# EasyEDA Pro project ProPrj_E73低功耗蓝牙键盘_2025-03-02.epro

# Schematic Schematic1
Board Name: Board1; Create Date: 2025-01-27; Page Name: E73主控; Project Name: E73低功耗蓝牙键盘; Schematic Name: Schematic1; Update Date: 2025-03-01; Company: 嘉立创EDA; Page Size: A4; Version: V1.2
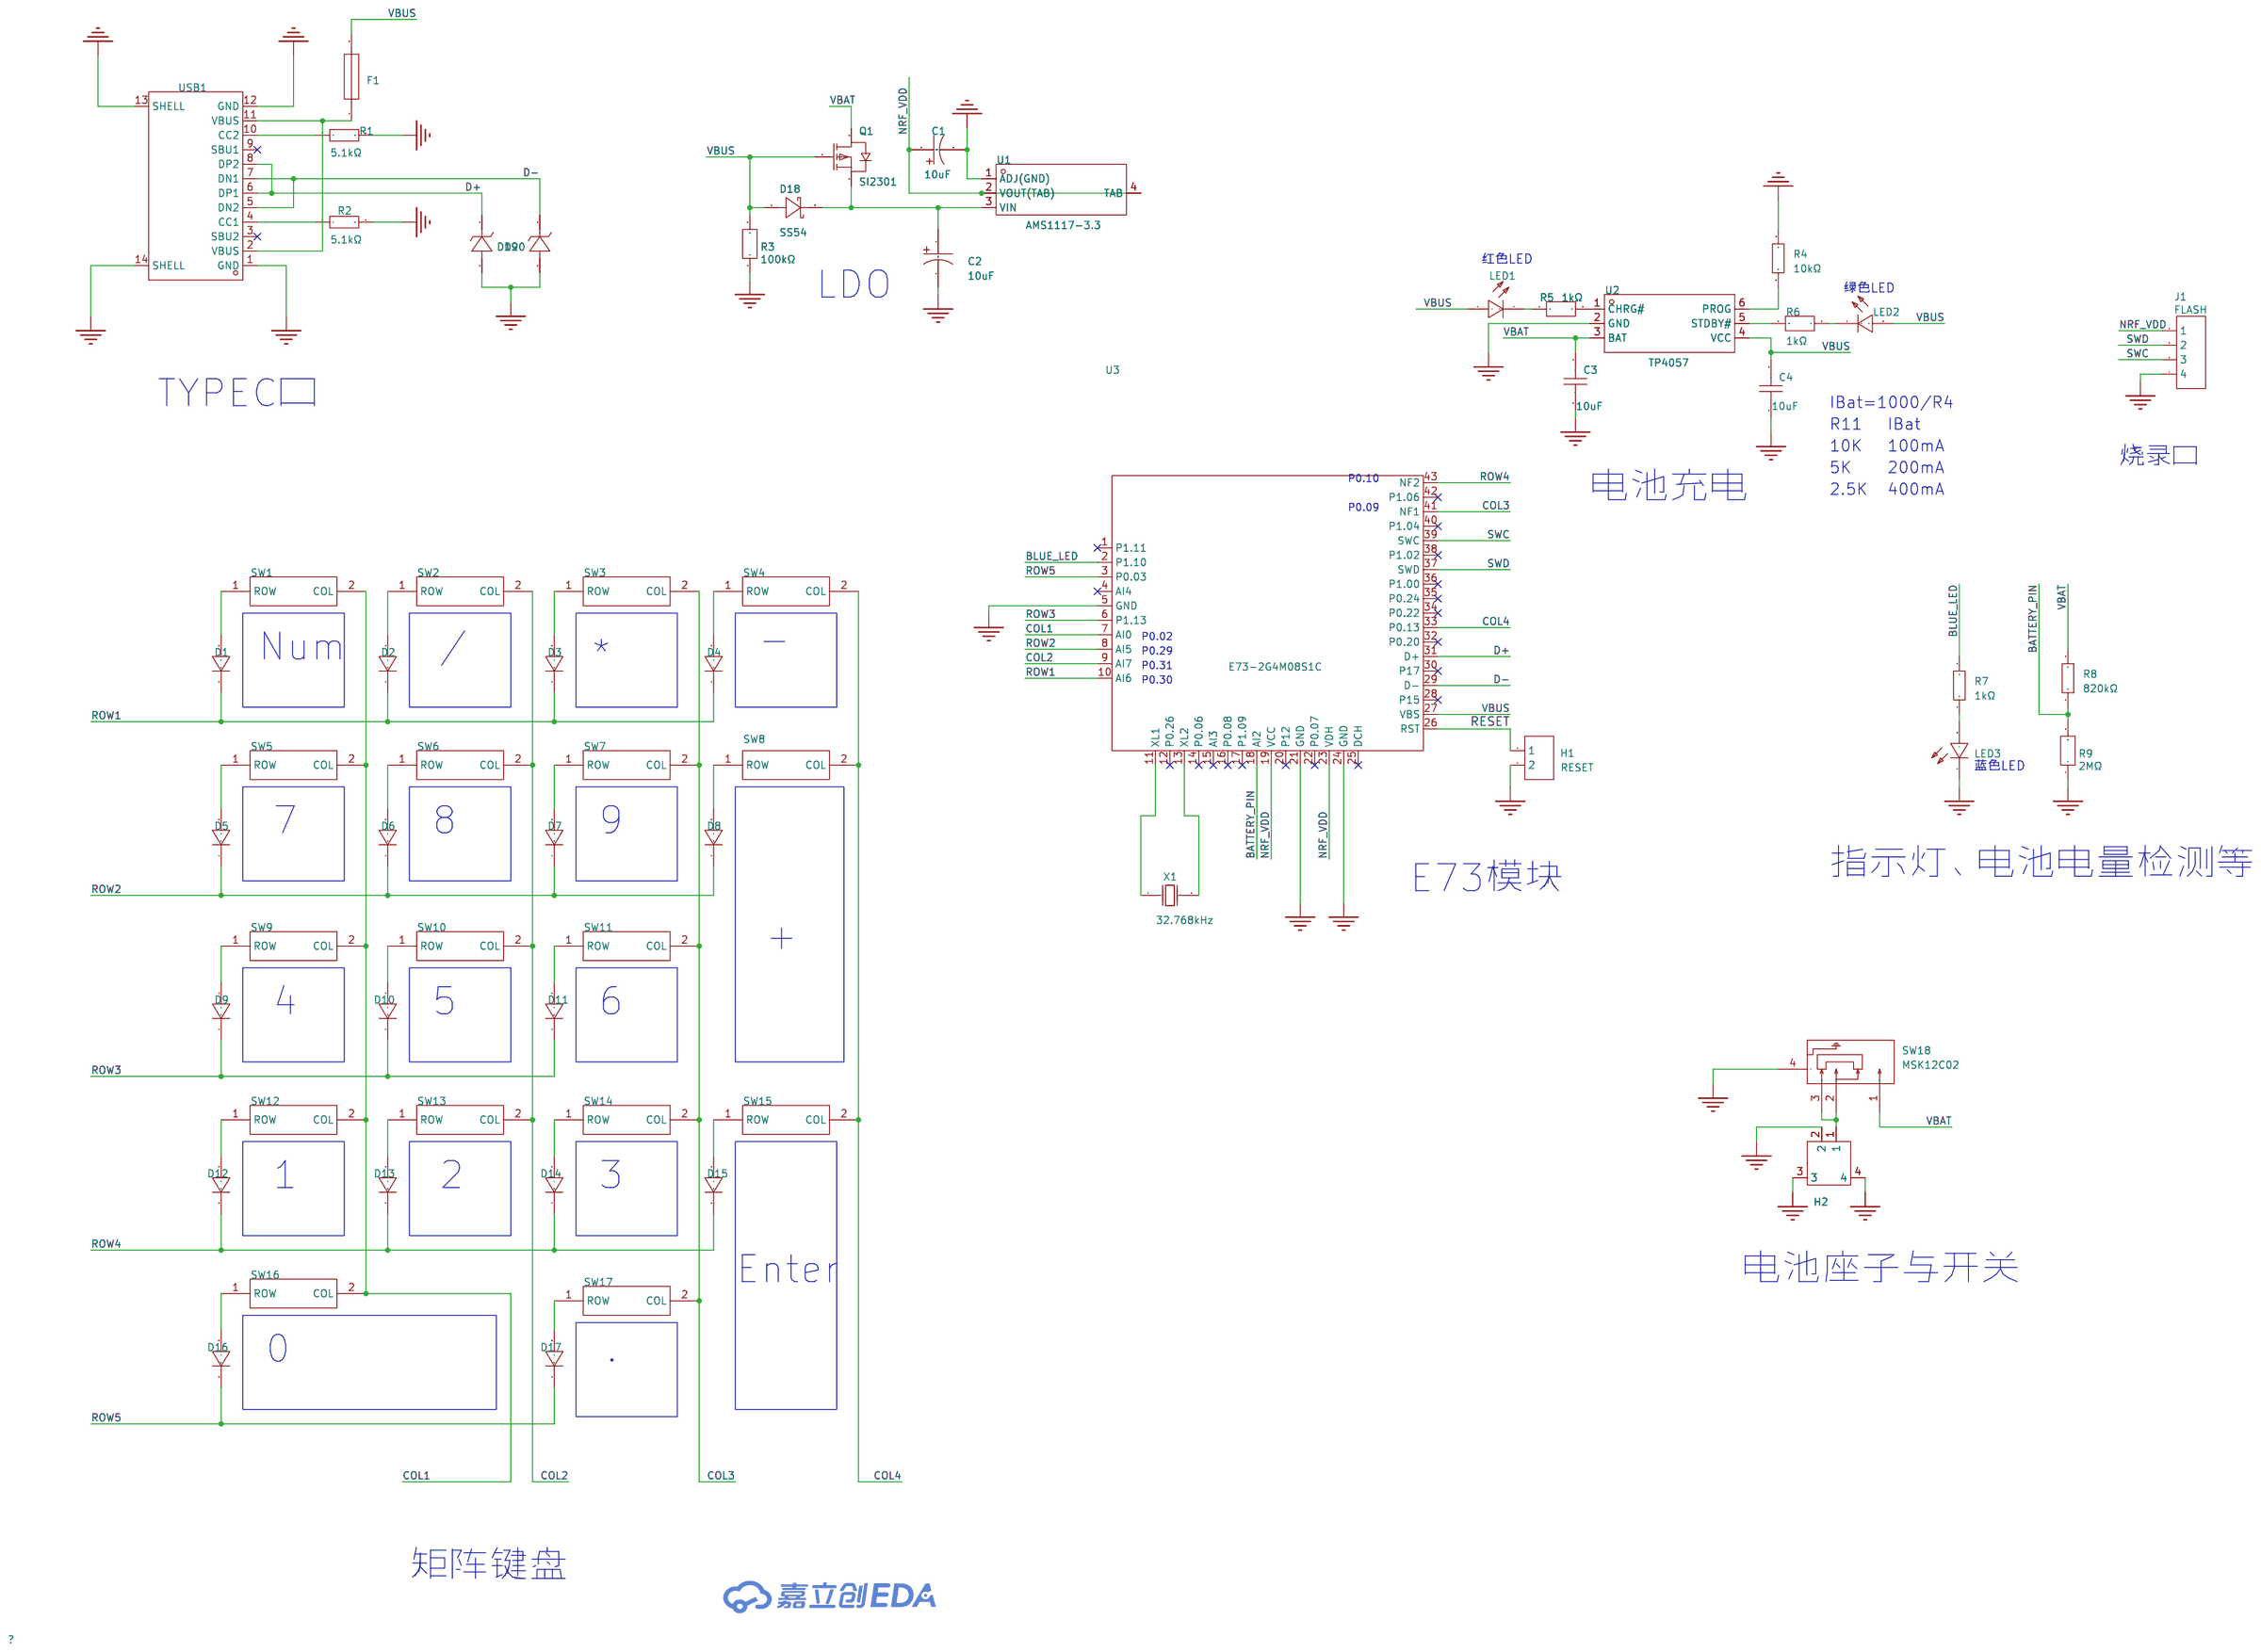
[diagram p0: schematic sheet]

## Parts
C1  10uF  [CAP-SMD_L3.2-W1.6]
C2  10uF  [CAP-SMD_L3.2-W1.6]
C3  10uF  [C0603]
C4  10uF  [C0603]
D1  LL4148  [LL-34_L3.5-W1.5-RD]
D2  LL4148  [LL-34_L3.5-W1.5-RD]
D3  LL4148  [LL-34_L3.5-W1.5-RD]
D4  LL4148  [LL-34_L3.5-W1.5-RD]
D5  LL4148  [LL-34_L3.5-W1.5-RD]
D6  LL4148  [LL-34_L3.5-W1.5-RD]
D7  LL4148  [LL-34_L3.5-W1.5-RD]
D8  LL4148  [LL-34_L3.5-W1.5-RD]
D9  LL4148  [LL-34_L3.5-W1.5-RD]
D10  LL4148  [LL-34_L3.5-W1.5-RD]
D11  LL4148  [LL-34_L3.5-W1.5-RD]
D12  LL4148  [LL-34_L3.5-W1.5-RD]
D13  LL4148  [LL-34_L3.5-W1.5-RD]
D14  LL4148  [LL-34_L3.5-W1.5-RD]
D15  LL4148  [LL-34_L3.5-W1.5-RD]
D16  LL4148  [LL-34_L3.5-W1.5-RD]
D17  LL4148  [LL-34_L3.5-W1.5-RD]
D18  SS54  [SMA_L4.3-W2.6-LS5.0-FD]
D19  BZT52C3V6S  [SOD-323_L1.7-W1.3-LS2.6-RD]
D20  BZT52C3V6S  [SOD-323_L1.7-W1.3-LS2.6-RD]
F1  JK-nSMD050-30  [F1206]
H1  RESET  [PIN02]  (no BOM)
H2  2.54-2P WT  [CONN-SMD_2.54-2PWT]
J1  FLASH  [PIN04]  (no BOM)
LED1  NCD0603R1  [LED0603-RD_RED]
LED2  NCD0603G1  [LED0603-RD_1]
LED3  NCD0603B1  [LED0603-RD]
Q1  SI2301  [SOT-23-3_L2.9-W1.3-P1.90-LS2.4-BR]
R1  5.1kΩ  [R0603]
R2  5.1kΩ  [R0603]
R3  100kΩ  [R0603]
R4  10kΩ  [R0603]
R5  1kΩ  [R0603]
R6  1kΩ  [R0603]
R7  1kΩ  [R0603]
R8  820kΩ  [R0603]
R9  2MΩ  [R0603]
SW1  -  [键盘轴座(无灯)]
SW2  -  [键盘轴座(无灯)]
SW3  -  [键盘轴座(无灯)]
SW4  -  [键盘轴座(无灯)]
SW5  -  [键盘轴座(无灯)]
SW6  -  [键盘轴座(无灯)]
SW7  -  [键盘轴座(无灯)]
SW8  -  [键盘轴座(无灯)]
SW9  -  [键盘轴座(无灯)]
SW10  -  [键盘轴座(无灯)]
SW11  -  [键盘轴座(无灯)]
SW12  -  [键盘轴座(无灯)]
SW13  -  [键盘轴座(无灯)]
SW14  -  [键盘轴座(无灯)]
SW15  -  [键盘轴座(无灯)]
SW16  -  [键盘轴座(无灯)]
SW17  -  [键盘轴座(无灯)]
SW18  MSK12C02  [SW-TH_MSK12C02]
U1  AMS1117-3.3  [SOT-223-4_L6.5-W3.5-P2.30-LS7.0-BR]
U2  TP4057  [SOT-23-6_L2.9-W1.6-P0.95-LS2.8-BR]
U3  E73-2G4M08S1C  [WIRELM-SMD_E73-2G4M08S1C]
USB1  TYPE-C 16PIN 2MD(073)  [USB-C-SMD_TYPE-C-6PIN-2MD-073]
X1  32.768kHz  [CRYSTAL-SMD_L3.2-W1.5-1]

## Library data of the parts
C1 C2 = CA45-A-16V-10μF-K: 容值:10uF;精度:±10%;额定电压:16V;等效串联电阻:2Ω@100kHz;; LCSC Part Name: 10uF ±10% 16V; Supplier Part: C185774; Manufacturer: TORCH(火炬); Supplier Footprint: CASE-A-3216-16(mm); JLCPCB Part Class: 扩展库; Datasheet: https://atta.szlcsc.com/upload/public/pdf/source/20180731/C185774_22D18ADF2389DA8E0E2B47A85772FA52.pdf; Supplier: LCSC; Tolerance: ±10%; Rated Voltage: 16V; Equivalent Series Resistance(ESR): 2Ω@100kHz; Operating Temperature: -55℃~+125℃
C3 C4 = HGC0603R5106M160NTHJ: 容值:10uF;精度:±20%;额定电压:16V;材质(温度系数):X5R;; LCSC Part Name: 10uF ±20% 16V; Supplier Part: C7472959; Manufacturer: Chinocera(华瓷); Supplier Footprint: 0603; JLCPCB Part Class: 扩展库; Datasheet: https://atta.szlcsc.com/upload/public/pdf/source/20240320/FAC3FEC40A78BC5CCCE96C232A94D860.pdf; Supplier: LCSC; Tolerance: ±20%; Voltage Rated: 16V; Temperature Coefficient: X5R
D1-D17 = LL4148_C435829: 二极管配置:-;正向压降(Vf):1V@10mA;直流反向耐压(Vr):75V;整流电流:200mA;反向恢复时间(trr):4ns;; LCSC Part Name: 电压:75V 电流:200mA; Supplier Part: C435829; Manufacturer: MDD(辰达半导体); Supplier Footprint: LL-34; JLCPCB Part Class: 扩展库; Datasheet: https://atta.szlcsc.com/upload/public/pdf/source/20230823/CF1FBF721ECE2AB22ACED5F4B72E76C8.pdf; Supplier: LCSC; Forward Voltage (Vf@If): 1V@10mA; Reverse Voltage (Vr): 75V; Rectified Current: 200mA; Reverse Leakage Current: 5uA@75V; Reverse Recovery Time (trr): 4ns
D18 = SS54_C7420369: 二极管配置:独立式;正向压降(Vf):550mV@5.0A;直流反向耐压(Vr):40V;整流电流:5A;; LCSC Part Name: 电压:40V 电流:5A; Supplier Part: C7420369; Manufacturer: 宏迦橙; Supplier Footprint: SMA(DO-214AC); JLCPCB Part Class: 扩展库; Datasheet: https://atta.szlcsc.com/upload/public/pdf/source/20230828/254C3882F8647358AD9F60DD73611B5E.pdf; Supplier: LCSC; Diode Configuration: 独立式; Forward Voltage (Vf@If): 550mV@5.0A; Reverse Voltage (Vr): 40V; Rectified Current: 5A; Reverse Leakage Current (Ir): 50uA@40V
D19 D20 = BZT52C3V6S_C19077438: 二极管配置:独立式;稳压值(标称值):3.6V;稳压值(范围):3.4V~3.8V;功率(Pd):200mW;; Supplier Part: C19077438; Manufacturer: 宏迦橙; Supplier Footprint: SOD-323; JLCPCB Part Class: 扩展库; Datasheet: https://atta.szlcsc.com/upload/public/pdf/source/20231117/06CD1C2A69B3FFC97FEAE4263E1B2FE9.pdf; Supplier: LCSC; Diode Configuration: 独立式; Zener Voltage (Nom): 3.6V; Reverse Leakage Current (Ir): 5uA@1V; Zener Voltage (Range): 3.4V~3.8V; Power Dissipation: 200mW; Zener Impedance (Zzt): 90Ω
F1 = JK-nSMD050-30: 最大电压:30V;最大电流:100A;保持电流:500mA;跳闸电流:1A;; LCSC Part Name: 30V 500mA 1206自恢复; Supplier Part: C720075; Manufacturer: JK(金科); Supplier Footprint: 1206; JLCPCB Part Class: 扩展库; Datasheet: https://atta.szlcsc.com/upload/public/pdf/source/20200810/C720075_06AF2D4541537091880CC35F0EFB49F8.pdf; Supplier: LCSC; Operating Voltage (Max): 30V; Current Rating (Max): 100A; Hold Current: 500mA; Trip Current: 1A; Power Dissipation: 600mW; Resistance - Initial (Ri) (Min): 150mΩ; Resistance - Post Trip (R1) (Max): 300mΩ; Maximum Time to Trip: 100ms; Operating Temperature: -40℃~+85℃
H1 = RESET: Supplier Part: C49661; Supplier: LCSC
H2 = 2.54-2P WT: 插针结构:1x2P;间距:2.5mm;安装方式:卧贴;参考系列:XH;总PIN数:2P;排数:1;每排PIN数:2;行距:-;额定电流:3A;触头材质:黄铜;触头镀层:锡;工作温度范围:-25℃~+85℃;; LCSC Part Name: 1x2P 间距:2.5mm 卧贴 系列:XH; Supplier Part: C668622; Manufacturer: SHOU HAN(首韩); Supplier Footprint: SMD,P=2.5mm,卧贴; JLCPCB Part Class: Extended Part; Datasheet: https://atta.szlcsc.com/upload/public/pdf/source/20200618/C668622_3082D512A2EB4A80849D85A884B9E04D.pdf; Supplier: LCSC; Pins Structure: 1x2P; Pitch: 2.5mm; Mounting Type: 卧贴; Reference Series: XH; Number of Pins: 2P; Number of Rows: 1; Number of PINs Per Row: 2; Current Rating: 3A; Contact Material: 黄铜; Contact Plating: 锡; Operating Temperature: -25℃~+85℃; Voltage Rating: 250V; Plastic Material: LCP; Flame Retardant Rating: UL94V-0; Color: 米色
J1 = FLASH: Supplier Part: C225501; Supplier: LCSC
LED1 = NCD0603R1_C84263: 灯头类型:-;发光颜色:红色;正向电压(VF):1.6V~2.6V;功率:65mW;正向电流:20mA;主波长:615nm~630nm;二极管配置:独立二极管;透镜颜色:无色透明透镜;色温:-;发光强度:80mcd~220mcd;发光角度:130°;载带方式:-;工作温度:-30℃~+85℃;; Supplier Part: C84263; Manufacturer: 国星光电; Supplier Footprint: 0603; Datasheet: https://atta.szlcsc.com/upload/public/pdf/source/20200820/C84263_DABC6A75E58F576973B407FDBA283D60.pdf; Supplier: LCSC; Emitted Color: 红色; Forward Voltage (VF): 1.6V~2.6V; Power Dissipation: 65mW; Forward Current: 20mA; Dominant Wavelength: 615nm~630nm; Diode Configuration: 独立二极管; Lens Color: 无色透明透镜; Luminous Intensity: 80mcd~220mcd; Viewing Angle: 130°; Operating Temperature: -30℃~+85℃
LED2 = NCD0603G1: 发光颜色:翠绿色;正向电压(VF):2.6V~3.6V;功率:72mW;正向电流:10mA;主波长:515nm~530nm;透镜颜色:无色透明透镜;发光强度:330mcd~900mcd;发光角度:130°;工作温度:-30℃~+85℃;; Supplier Part: C84267; Manufacturer: 国星光电; Supplier Footprint: 0603; JLCPCB Part Class: 扩展库; Datasheet: https://atta.szlcsc.com/upload/public/pdf/source/20200820/C84267_04BA7703640BAC111D09F5EFB971FBF3.pdf; Supplier: LCSC; Emitted Color: 翠绿色; Forward Voltage (VF): 2.6V~3.6V; Power Dissipation: 72mW; Forward Current: 10mA; Dominant Wavelength: 515nm~530nm; Lens Color: 无色透明透镜; Luminous Intensity: 330mcd~900mcd; Viewing Angle: 130°; Operating Temperature: -30℃~+85℃
LED3 = NCD0603B1: 发光颜色:蓝色;正向电压(VF):2.6V~3.6V;功率:72mW;正向电流:10mA;主波长:463nm~475nm;透镜颜色:无色透明透镜;发光强度:80mcd~220mcd;发光角度:130°;工作温度:-30℃~+85℃;; Supplier Part: C84266; Manufacturer: 国星光电; Supplier Footprint: 0603; Datasheet: https://atta.szlcsc.com/upload/public/pdf/source/20200820/C84266_6A3CDBEFA72C6CAD68EDA53474ADAE6C.pdf; Supplier: LCSC; Emitted Color: 蓝色; Forward Voltage (VF): 2.6V~3.6V; Power Dissipation: 72mW; Forward Current: 10mA; Dominant Wavelength: 463nm~475nm; Lens Color: 无色透明透镜; Luminous Intensity: 80mcd~220mcd; Viewing Angle: 130°; Operating Temperature: -30℃~+85℃
Q1 = SI2301_C2891731: 类型:1个P沟道;漏源电压(Vdss):20V;连续漏极电流(Id):2.2A;导通电阻(RDS(on)@Vgs,Id):120mΩ@4.5V,1.5A;功率(Pd):700mW;阈值电压(Vgs(th)@Id):1.5V@250uA;; LCSC Part Name: P沟道,电流:2.2A,耐压:20V; Supplier Part: C2891731; Manufacturer: YONGYUTAI(永裕泰); Supplier Footprint: SOT-23; JLCPCB Part Class: 扩展库; Datasheet: https://atta.szlcsc.com/upload/public/pdf/source/20210901/BD7F488CADB80954861F21BEE026F08A.pdf; Supplier: LCSC; Type: 1个P沟道; Drain Source Voltage (Vdss): 20V; Continuous Drain Current (Id): 2.2A; Drain Source On Resistance (RDS(on)@Vgs,Id): 120mΩ@4.5V,1.5A; Power Dissipation (Pd): 700mW; Gate Threshold Voltage (Vgs(th)@Id): 1.5V@250uA; Input Capacitance (Ciss@Vds): 200pF@10V; Operating Temperature: -55℃~+150℃
R1 R2 = 0603WAF5101T5E: 电阻类型:厚膜电阻;阻值:5.1kΩ;精度:±1%;功率:100mW;最大工作电压:75V;温度系数:±100ppm/℃;; LCSC Part Name: 5.1kΩ ±1% 100mW 厚膜电阻; Supplier Part: C23186; Manufacturer: UNI-ROYAL(厚声); Supplier Footprint: 0603; JLCPCB Part Class: Basic Part; Datasheet: https://atta.szlcsc.com/upload/public/pdf/source/20200306/C422600_1E6D84923E4A46A82E41ADD87F860B5C.pdf; Supplier: LCSC; Type: 厚膜电阻; Tolerance: ±1%; Power(Watts): 100mW; Overload Voltage (Max): 75V; Temperature Coefficient: ±100ppm/℃; Operating Temperature Range: -55℃~+155℃
R3 = 0603WAF1003T5E: 电阻类型:厚膜电阻;阻值:100kΩ;精度:±1%;功率:100mW;最大工作电压:75V;温度系数:±100ppm/℃;; LCSC Part Name: 100kΩ ±1% 100mW 厚膜电阻; Supplier Part: C25803; Manufacturer: UNI-ROYAL(厚声); Supplier Footprint: 0603; JLCPCB Part Class: Basic Part; Datasheet: https://atta.szlcsc.com/upload/public/pdf/source/20200306/C422600_1E6D84923E4A46A82E41ADD87F860B5C.pdf; Supplier: LCSC; Type: 厚膜电阻; Tolerance: ±1%; Power(Watts): 100mW; Overload Voltage (Max): 75V; Temperature Coefficient: ±100ppm/℃; Operating Temperature Range: -55℃~+155℃
R4 = 0603WAF1002T5E: 电阻类型:厚膜电阻;阻值:10kΩ;精度:±1%;功率:100mW;最大工作电压:75V;温度系数:±100ppm/℃;; LCSC Part Name: 厚膜电阻 10kΩ ±1% 100mW; Supplier Part: C25804; Manufacturer: UNI-ROYAL(厚声); Supplier Footprint: 0603; JLCPCB Part Class: Basic Part; Datasheet: https://atta.szlcsc.com/upload/public/pdf/source/20200306/C422600_1E6D84923E4A46A82E41ADD87F860B5C.pdf; Supplier: LCSC; Type: 厚膜电阻; Tolerance: ±1%; Power(Watts): 100mW; Overload Voltage (Max): 75V; Temperature Coefficient: ±100ppm/℃; Operating Temperature Range: -55℃~+155℃
R5-R7 = 0603WAF1001T5E: 电阻类型:厚膜电阻;阻值:1kΩ;精度:±1%;功率:100mW;最大工作电压:75V;温度系数:±100ppm/℃;; LCSC Part Name: 1kΩ ±1% 100mW 厚膜电阻; Supplier Part: C21190; Manufacturer: UNI-ROYAL(厚声); Supplier Footprint: 0603; JLCPCB Part Class: 基础库; Datasheet: https://atta.szlcsc.com/upload/public/pdf/source/20200306/C422600_1E6D84923E4A46A82E41ADD87F860B5C.pdf; Supplier: LCSC; Type: 厚膜电阻; Tolerance: ±1%; Power(Watts): 100mW; Overload Voltage (Max): 75V; Temperature Coefficient: ±100ppm/℃; Operating Temperature Range: -55℃~+155℃
R8 = 0603WAF8203T5E: 电阻类型:厚膜电阻;阻值:820kΩ;精度:±1%;功率:100mW;最大工作电压:75V;温度系数:±100ppm/℃;; LCSC Part Name: 820kΩ ±1% 100mW 厚膜电阻; Supplier Part: C23252; Manufacturer: UNI-ROYAL(厚声); Supplier Footprint: 0603; JLCPCB Part Class: 扩展库; Datasheet: https://atta.szlcsc.com/upload/public/pdf/source/20200306/C422600_1E6D84923E4A46A82E41ADD87F860B5C.pdf; Supplier: LCSC; Type: 厚膜电阻; Tolerance: ±1%; Power(Watts): 100mW; Overload Voltage (Max): 75V; Temperature Coefficient: ±100ppm/℃; Operating Temperature Range: -55℃~+155℃
R9 = 0603WAF2004T5E: 电阻类型:厚膜电阻;阻值:2MΩ;精度:±1%;功率:100mW;最大工作电压:75V;温度系数:±100ppm/℃;; LCSC Part Name: 2MΩ ±1% 100mW 厚膜电阻; Supplier Part: C22976; Manufacturer: UNI-ROYAL(厚声); Supplier Footprint: 0603; JLCPCB Part Class: Basic Part; Datasheet: https://atta.szlcsc.com/upload/public/pdf/source/20200306/C422600_1E6D84923E4A46A82E41ADD87F860B5C.pdf; Supplier: LCSC; Type: 厚膜电阻; Tolerance: ±1%; Power(Watts): 100mW; Overload Voltage (Max): 75V; Temperature Coefficient: ±100ppm/℃; Operating Temperature Range: -55℃~+155℃
SW1-SW17 = 键盘轴座(无灯)
SW18 = MSK12C02: 电路结构:单刀双掷;安装方式:卧贴;开关颜色:-;额定电流(DC):50mA;额定电压(DC):12V;额定电流(AC):-;额定电压(AC):-;机械寿命:1万次;; LCSC Part Name: 两档侧拨贴片 7脚 滑动开关; Supplier Part: C431540; Manufacturer: SHOU HAN(首韩); Supplier Footprint: SMD; JLCPCB Part Class: 扩展库; Datasheet: https://atta.szlcsc.com/upload/public/pdf/source/20190925/C431540_89155AEF0758B9AD1B2D805F83FB12E3.pdf; Supplier: LCSC; Circuit: 单刀双掷; Pin Style: SMD接片; Switch Length: 8mm; Switch Width: 2.8mm; Switch Height: 1.4mm; Mounting Style: 卧贴; Current Rating (DC): 50mA; Voltage Rating (DC): 12V; Mechanical Life: 1万次; Operating Temperature: -20℃~+70℃
U1 = AMS1117-3.3_C347222: 输出类型:固定;工作电压:12V;输出电压:3.3V;输出电流:1A;电源纹波抑制比(PSRR):60dB@(120Hz);输出极性:正极;; LCSC Part Name: 输出:3.3V 电流:1A 耐压:12V; Supplier Part: C347222; Manufacturer: UMW(友台半导体); Supplier Footprint: SOT-223; JLCPCB Part Class: 扩展库; Datasheet: https://atta.szlcsc.com/upload/public/pdf/source/20241218/BAF0263FA2E44BCD8AF41AA4FA04EFAA.pdf; Supplier: LCSC; Output Type: 固定; Maximum Input Voltage: 12V; Output Voltage: 3.3V; Output Current: 1A; Power Supply Rejection Ratio (PSRR): 60dB@(120Hz); Dropout Voltage: 1.3V@(1A); Feature: 过流保护(OCP); Output Polarity: 正极; Number of Outputs: 1
U2 = TP4057: 电源电压:6.5V;最大充电电流:500mA;电池类型:锂离子/聚合物;电池节数:1;; Supplier Part: C725791; Manufacturer: UMW(友台半导体); Supplier Footprint: SOT-23-6; JLCPCB Part Class: 扩展库; Datasheet: https://atta.szlcsc.com/upload/public/pdf/source/20231109/7FB39B0490CD1514A6792371FCA0BB30.pdf; Supplier: LCSC; Supply Voltage: 6.5V; Maximum Charge Current: 500mA; Type of Battery: 锂离子/聚合物; Number of Cells: 1; Operating Temperature: -40℃~+85℃
U3 = E73-2G4M08S1C: 1、原装进口nRF52840射频芯片。2、支持蓝牙4.2和5.0协议。3、芯片自带高性能ARM CORTEX-M4F内核。4、芯片自带32.768K实时时钟。5、四层高性能PCB板，射频特性优异，可以通过各种认证。6、模块引出了大部分的IO口。7、模块出厂无程序，用户需要进行二次开发。; Supplier Part: C356849; Manufacturer: EBYTE(亿佰特); Datasheet: https://atta.szlcsc.com/upload/public/pdf/source/20190802/C356849_057FD2ABDA7635054C2E243A545E6C9F.pdf; Supplier: LCSC
USB1 = TYPE-C 16PIN 2MD(073): 连接器类型:Type-C;标准:USB 3.1;公母:母;安装方式:卧贴;触点数量:16P;端口数量:1;额定电流 - 电源:5A;工作温度范围:-25℃~+85℃;; LCSC Part Name: Type-C 母 卧贴; Supplier Part: C2765186; Manufacturer: SHOU HAN(首韩); Supplier Footprint: SMD; JLCPCB Part Class: 扩展库; Datasheet: https://atta.szlcsc.com/upload/public/pdf/source/20211123/39B17C16241EAC15C5E277BDA434118E.pdf; Supplier: LCSC; Connector Type: Type-C; Standard: USB 3.1; Gender: 母; Mounting Style: 卧贴; Number of Contacts: 16P; Number of Ports: 1; Current Rating - Power (Max): 5A; Operating Temperature Range: -25℃~+85℃; Rated Voltage (Max): 5V; Connect-Disconnect Life: 5千次; Core Colour: 黑色
X1 = XKXGI-SUA-32.768K: 晶振类型:贴片晶振;频率:32.768kHz;常温频差:±20ppm;负载电容:12.5pF;频率稳定度:±30ppm;; LCSC Part Name: 32.768kHz ±20ppm 12.5pF; Supplier Part: C5213671; Manufacturer: YXC(扬兴晶振); Supplier Footprint: SMD3215-2P; JLCPCB Part Class: 扩展库; Datasheet: https://atta.szlcsc.com/upload/public/pdf/source/20240329/3A7650FD985DD0DE85694D3785AB4916.pdf; Supplier: LCSC; Crystal Type: 贴片晶振; Normal temperature Frequency Tolerance: ±20ppm; Load Capacitor: 12.5pF; Frequency Stability: ±30ppm; Operating Temperature: -40℃~+85℃

## Nets
GND: C1.2 C2.2 C3.2 C4.1 D19.2(A) D20.2(A) H1.2 H2.2 H2.3 H2.4 J1.4 LED3.1(-) R1.2 R2.2 R3.1 R4.2 R9.1 SW18.4 U1.1(ADJ(GND)) U2.2(GND) U3.5(GND) U3.21(GND) U3.24(GND) USB1.1(GND) USB1.12(GND) USB1.13(SHELL) USB1.14(SHELL)
VBAT: C3.1 Q1.3(D) R8.2 SW18.1 U2.3(BAT)
VBUS: C4.2 D18.1(A) F1.2 LED1.2(A) LED2.2(A) Q1.1(G) R3.2 U2.4(VCC) U3.27(VBS)
BATTERY_PIN: R8.1 R9.2 U3.18(AI2)
BLUE_LED: R7.2 U3.2(P1.10)
COL1: SW1.2(COL) SW5.2(COL) SW9.2(COL) SW12.2(COL) SW16.2(COL) U3.7(AI0)
COL2: SW2.2(COL) SW6.2(COL) SW10.2(COL) SW13.2(COL) U3.9(AI7)
COL3: SW3.2(COL) SW7.2(COL) SW11.2(COL) SW14.2(COL) SW17.2(COL) U3.41(NF1)
COL4: SW4.2(COL) SW8.2(COL) SW15.2(COL) U3.33(P0.13)
D+: D19.1(K) U3.31(D+) USB1.6(DP1) USB1.8(DP2)
D-: D20.1(K) U3.29(D-) USB1.5(DN2) USB1.7(DN1)
NRF_VDD: C1.1 J1.1 U1.2(VOUT(TAB)) U1.4(TAB) U3.19(VCC) U3.23(VDH)
RESET: H1.1 U3.26(RST)
ROW1: D1.1(C) D2.1(C) D3.1(C) D4.1(C) U3.10(AI6)
ROW2: D5.1(C) D6.1(C) D7.1(C) D8.1(C) U3.8(AI5)
ROW3: D9.1(C) D10.1(C) D11.1(C) U3.6(P1.13)
ROW4: D12.1(C) D13.1(C) D14.1(C) D15.1(C) U3.43(NF2)
ROW5: D16.1(C) D17.1(C) U3.3(P0.03)
SWC: J1.3 U3.39(SWC)
SWD: J1.2 U3.37(SWD)
$1N3146: U3.11(XL1) X1.1(OSC1)
$1N3148: U3.13(XL2) X1.2(OSC2)
$1N4004: F1.1 USB1.2(VBUS) USB1.11(VBUS)
$1N4007: R1.1 USB1.10(CC2)
$1N4018: R2.1 USB1.4(CC1)
$1N4421: LED3.2(+) R7.1
$1N18766: C2.1 D18.2(K) Q1.2(S) U1.3(VIN)
$1N20018: H2.1 SW18.2 SW18.3
$1N24035: R6.2 U2.5(STDBY#)
$1N24165: LED2.1(K) R6.1
$1N24411: LED1.1(K) R5.1
$1N24412: R5.2 U2.1(CHRG#)
$1N24490: R4.1 U2.6(PROG)
$1N53538: D3.2(A) SW3.1(ROW)
$1N53539: D2.2(A) SW2.1(ROW)
$1N53540: D1.2(A) SW1.1(ROW)
$1N53541: D4.2(A) SW4.1(ROW)
$1N53542: D7.2(A) SW7.1(ROW)
$1N53544: D5.2(A) SW5.1(ROW)
$1N53545: D9.2(A) SW9.1(ROW)
$1N53547: D11.2(A) SW11.1(ROW)
$1N53548: D8.2(A) SW8.1(ROW)
$1N53550: D13.2(A) SW13.1(ROW)
$1N53551: D12.2(A) SW12.1(ROW)
$1N53552: D16.2(A) SW16.1(ROW)
$1N56506: D10.2(A) SW10.1(ROW)
$1N56555: D14.2(A) SW14.1(ROW)
$1N56961: D6.2(A) SW6.1(ROW)
$1N57097: D15.2(A) SW15.1(ROW)
$1N57128: D17.2(A) SW17.1(ROW)

Not connected (* = marked no-connect by the designer): U3 1(P1.11)* 4(AI4)* 12(P0.26)* 14(P0.06)* 15(AI3)* 16(P0.08)* 17(P1.09)* 20(P12)* 22(P0.07)* 25(DCH)* 28(P15)* 30(P17)* 32(P0.20)* 34(P0.22)* 35(P0.24)* 36(P1.00)* 38(P1.02)* 40(P1.04)* 42(P1.06)*; USB1 3(SBU2)* 9(SBU1)*

## Notes on the sheet
- 红色LED
- LDO
- 绿色LED
- TYPEC口
- IBat=1000/R4
- R11
- IBat
- 10K
- 100mA
- 烧录口
- P0.10
- 5K
- 200mA
- P0.09
- 电池充电
- 2.5K
- 400mA
- P0.02
- -
- P0.29
- Num
- /
- *
- P0.31
- P0.30
- 蓝色LED
- 7
- 8
- 9
- 指示灯、电池电量检测等
- E73模块
- +
- 4
- 5
- 6
- 1
- 2
- 3
- Enter
- 电池座子与开关
- 0
- .
- 矩阵键盘

# Board PCB1
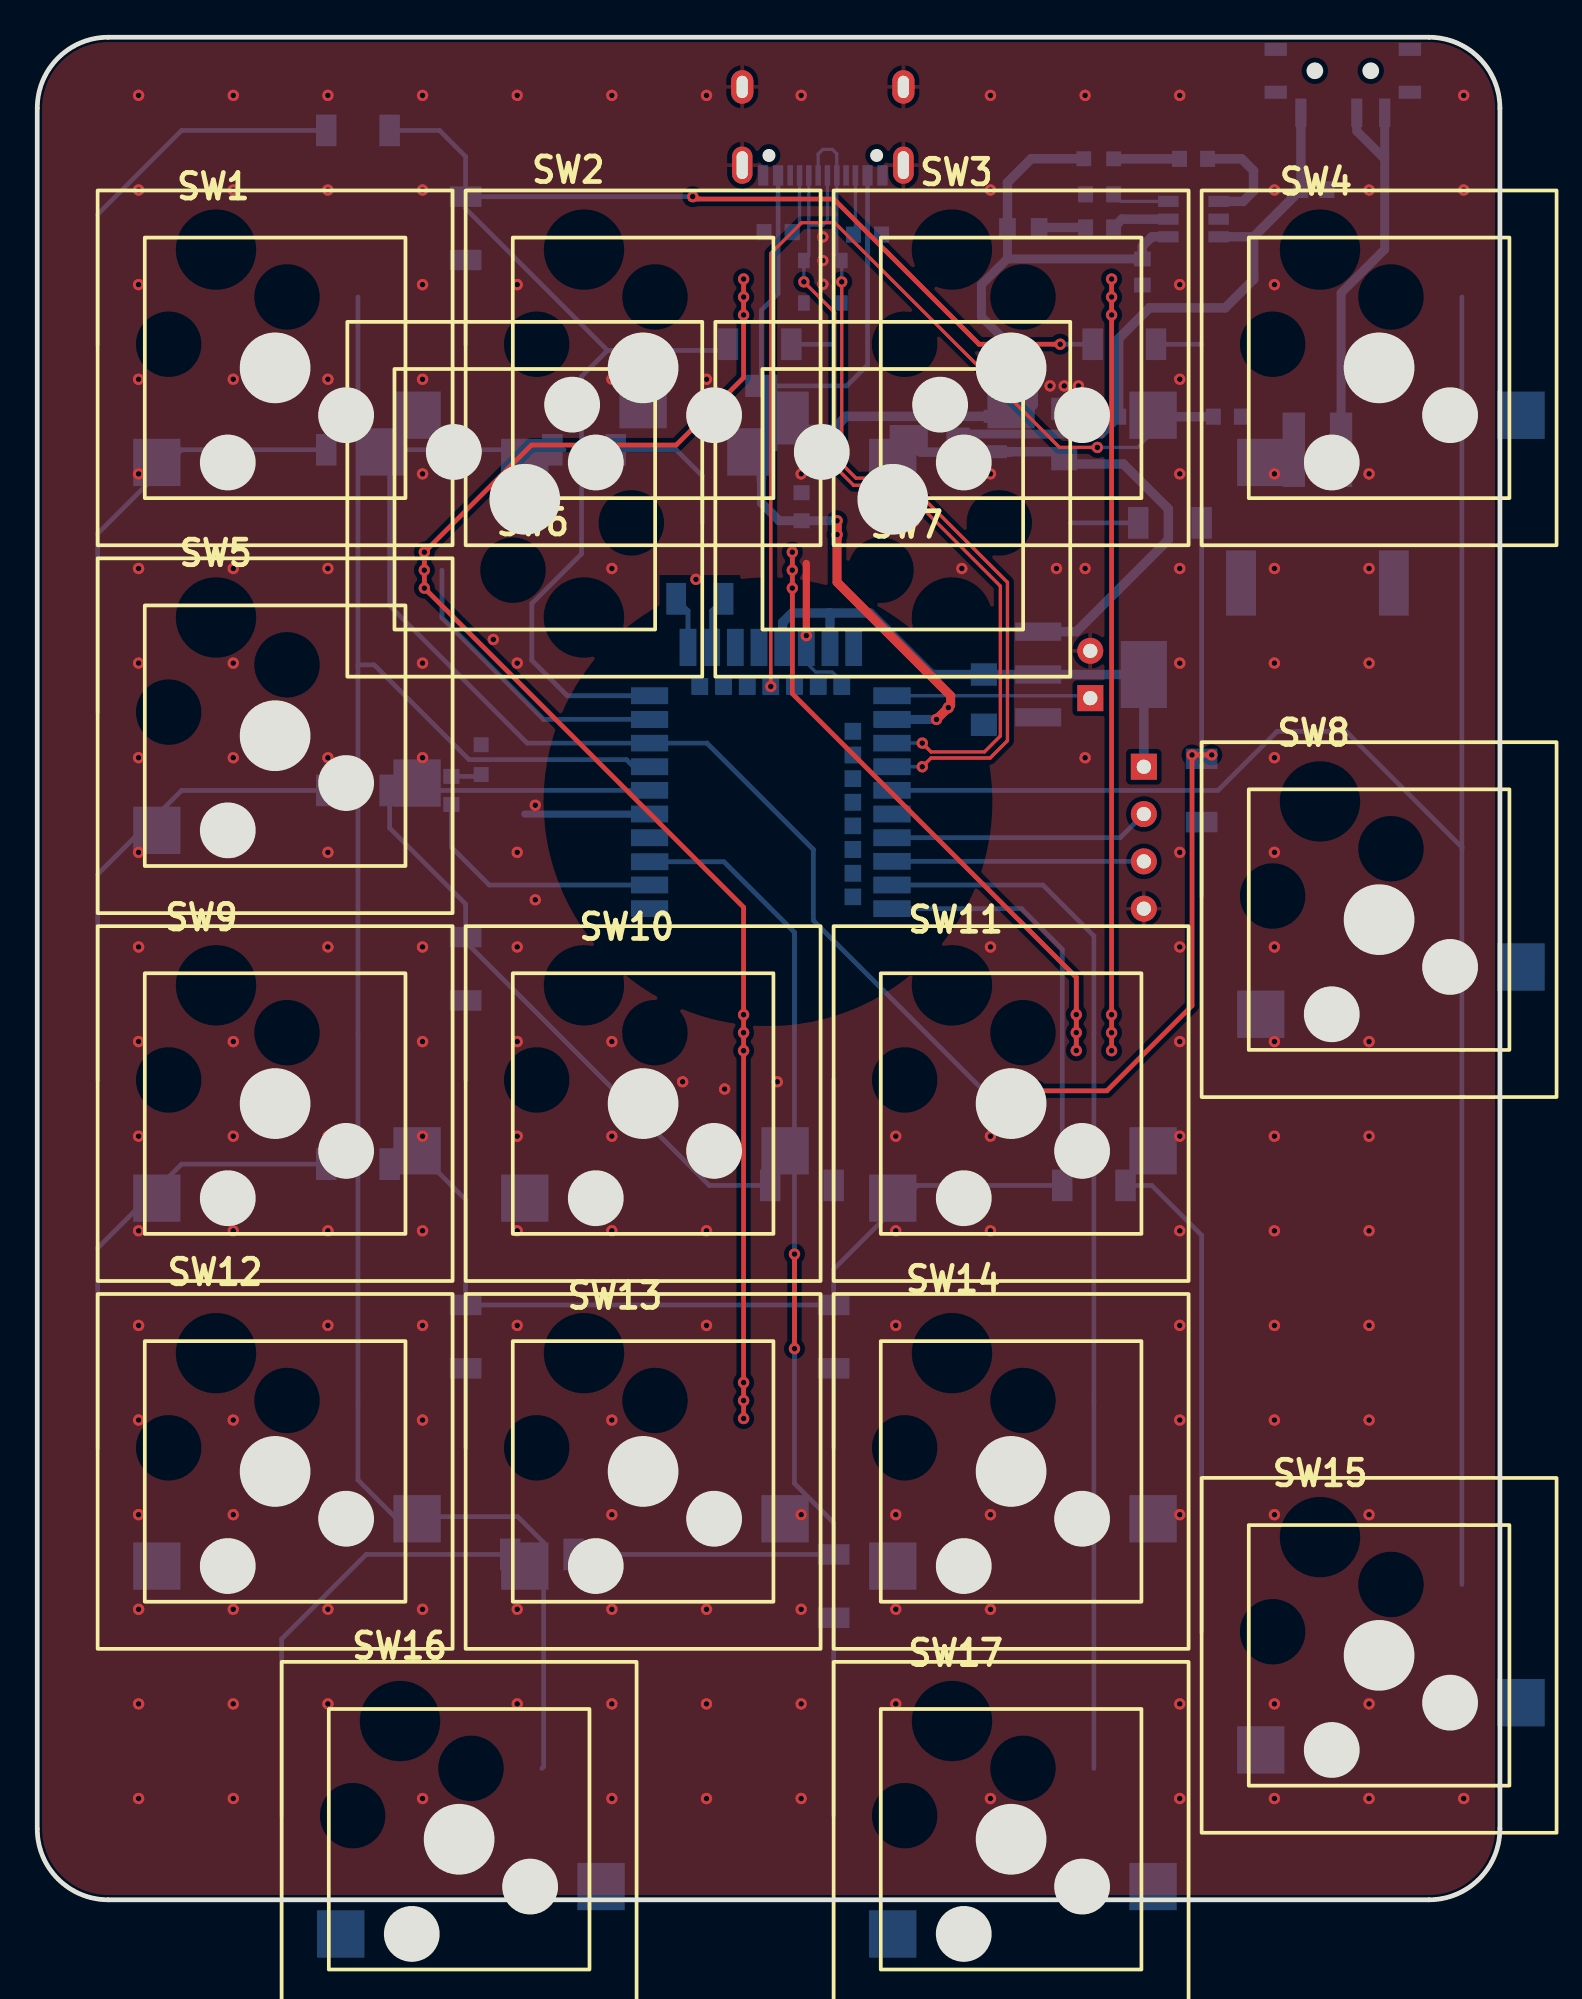
[diagram p1: board, top side]
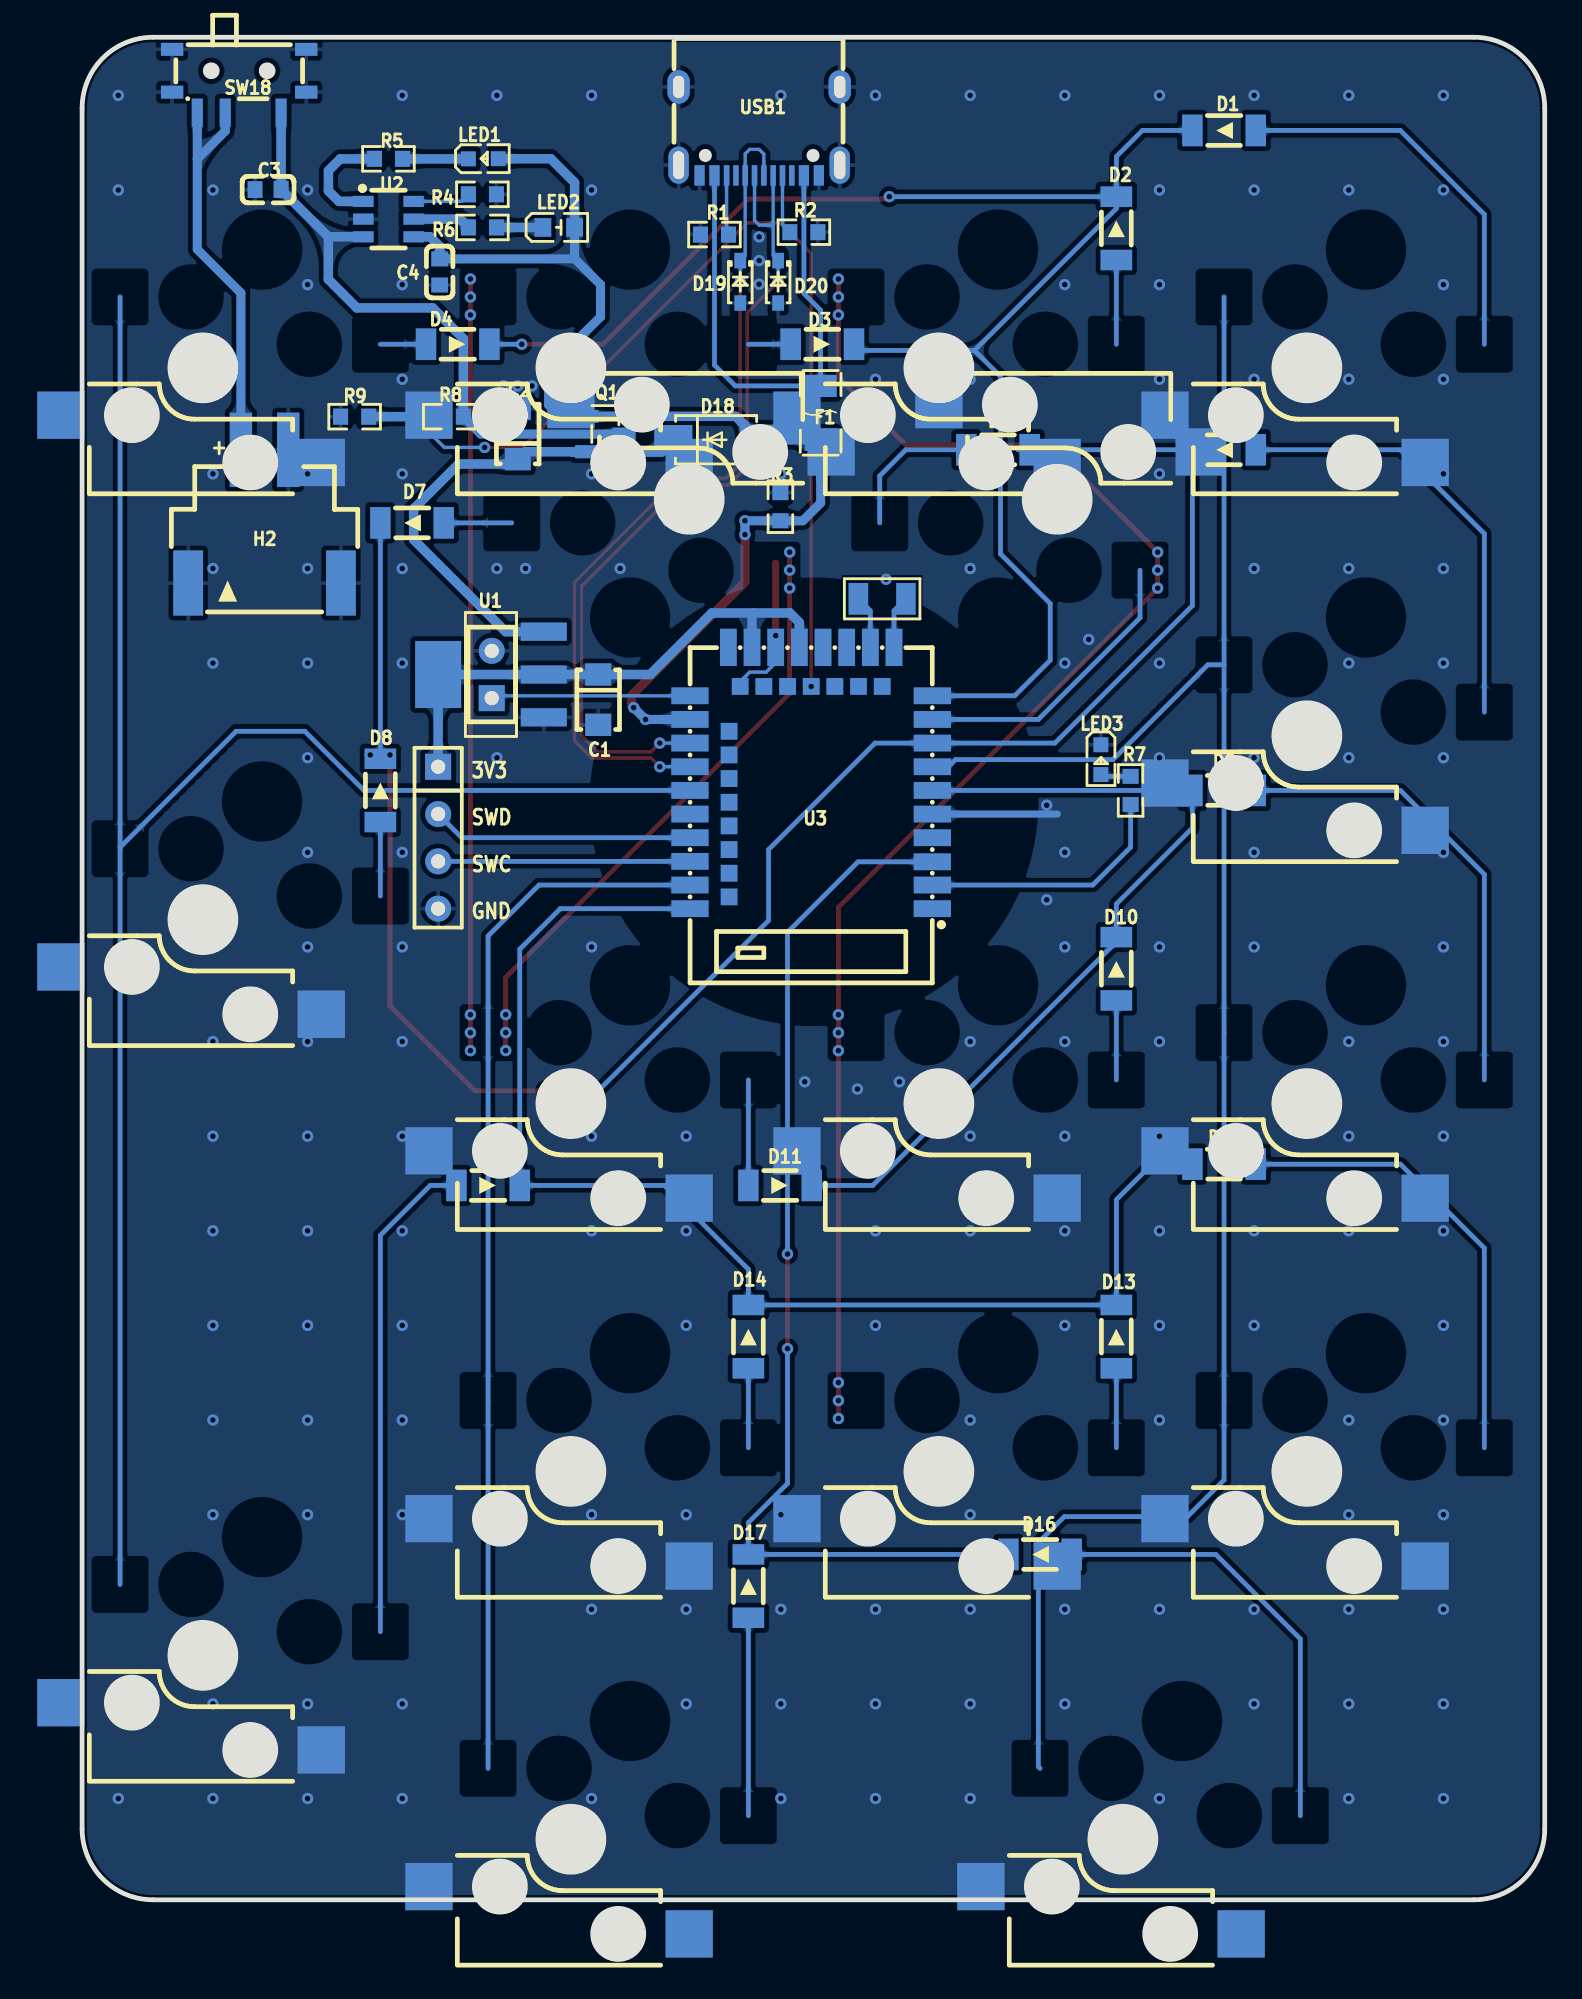
[diagram p2: board, bottom side, seen from below]

Outline 78.5 x 103.33 mm; copper layers: Top Layer, Bottom Layer. Coordinates in mm from the lower left corner of the outline.
Outline path: 0,99.52 arc(1.12,102.21) 3.81,103.33 74.69,103.33 arc(77.38,102.21) 78.5,99.52 78.5,7.14 arc(77.38,4.44) 74.69,3.33 3.81,3.33 arc(1.12,4.44) 0,7.14 0,99.52
Stack: Top Layer 0.035mm / Dielectric1 1.51mm FR4 er 4.5 / Bottom Layer 0.035mm

## Design rules (mm)
net D+: DP1
net D-: DP1
template: JLCPCB Capability(Two Layers Board)
spacing copperThickness1oz (default): track to track 0.102, other pairs 0.152 to 0.3
spacing copperThickness2oz: track to track 0.203, other pairs 0.152 to 0.3
track width copperThickness1oz (default): min 0.127, default 0.254, max 2.54
track width copperThickness2oz: min 0.203, default 0.254, max 2.54
differential pair differentialPair (default): width min 0.127, default 0.254, max 2.54; gap min 0.152, default 0.152
via viaSize (default): diameter min 0.5, default 0.61, max 10; hole min 0.3, default 0.305, max 6.3

## Placement (name value [footprint] x y rotation side)
C1  10uF  [CAP-SMD_L3.2-W1.6]  50.8 67.76 270 bottom
C2  10uF  [CAP-SMD_L3.2-W1.6]  55.12 82.02 90 bottom
C3  10uF  [C0603]  68.52 95.15 0 bottom
C4  10uF  [C0603]  59.31 90.72 90 bottom
D1  LL4148  [LL-34_L3.5-W1.5-RD]  17.21 98.32 180 bottom
D2  LL4148  [LL-34_L3.5-W1.5-RD]  22.99 93.07 270 bottom
D3  LL4148  [LL-34_L3.5-W1.5-RD]  38.77 86.84 0 bottom
D4  LL4148  [LL-34_L3.5-W1.5-RD]  58.34 86.84 0 bottom
D5  LL4148  [LL-34_L3.5-W1.5-RD]  17.21 81.18 180 bottom
D6  LL4148  [LL-34_L3.5-W1.5-RD]  29.34 81.18 0 bottom
D7  LL4148  [LL-34_L3.5-W1.5-RD]  60.79 77.25 180 bottom
D8  LL4148  [LL-34_L3.5-W1.5-RD]  62.49 62.89 270 bottom
D9  LL4148  [LL-34_L3.5-W1.5-RD]  17.21 62.89 180 bottom
D10  LL4148  [LL-34_L3.5-W1.5-RD]  22.99 53.31 270 bottom
D11  LL4148  [LL-34_L3.5-W1.5-RD]  41.04 41.68 0 bottom
D12  LL4148  [LL-34_L3.5-W1.5-RD]  17.21 42.82 180 bottom
D13  LL4148  [LL-34_L3.5-W1.5-RD]  22.99 33.56 270 bottom
D14  LL4148  [LL-34_L3.5-W1.5-RD]  42.74 33.56 270 bottom
D15  LL4148  [LL-34_L3.5-W1.5-RD]  56.71 41.68 0 bottom
D16  LL4148  [LL-34_L3.5-W1.5-RD]  27.09 21.87 180 bottom
D17  LL4148  [LL-34_L3.5-W1.5-RD]  42.74 20.17 270 bottom
D18  SS54  [SMA_L4.3-W2.6-LS5.0-FD]  44.47 81.71 0 bottom
D19  BZT52C3V6S  [SOD-323_L1.7-W1.3-LS2.6-RD]  43.18 90.2 270 bottom
D20  BZT52C3V6S  [SOD-323_L1.7-W1.3-LS2.6-RD]  41.14 90.2 270 bottom
F1  JK-nSMD050-30  [F1206]  38.86 83.16 270 bottom
H1  RESET  [PIN02]  56.51 69.11 90 bottom
H2  2.54-2P WT  [CONN-SMD_2.54-2PWT]  68.71 77.6 180 bottom
J1  FLASH  [PIN04]  59.39 60.35 180 bottom
LED1  NCD0603R1  [LED0603-RD_RED]  56.97 96.8 180 bottom
LED2  NCD0603G1  [LED0603-RD_1]  52.92 93.11 180 bottom
LED3  NCD0603B1  [LED0603-RD]  23.82 64.54 270 bottom
Q1  SI2301  [SOT-23-3_L2.9-W1.3-P1.90-LS2.4-BR]  50.42 82.02 0 bottom
R1  5.1kΩ  [R0603]  44.56 92.73 0 bottom
R2  5.1kΩ  [R0603]  39.76 92.86 180 bottom
R3  100kΩ  [R0603]  41.02 78.12 270 bottom
R4  10kΩ  [R0603]  57.01 94.89 180 bottom
R5  1kΩ  [R0603]  62.06 96.8 0 bottom
R6  1kΩ  [R0603]  57.01 93.11 0 bottom
R7  1kΩ  [R0603]  22.22 62.89 270 bottom
R8  820kΩ  [R0603]  58.79 82.95 180 bottom
R9  2MΩ  [R0603]  63.87 82.95 180 bottom
SW1  -  [键盘轴座(无灯)]  9.59 91.92 0 top
SW2  -  [键盘轴座(无灯)]  29.34 91.92 0 top
SW3  -  [键盘轴座(无灯)]  49.09 91.92 0 top
SW4  -  [键盘轴座(无灯)]  68.84 91.92 0 top
SW5  -  [键盘轴座(无灯)]  9.59 72.17 0 top
SW6  -  [键盘轴座(无灯)]  29.34 72.17 180 top
SW7  -  [键盘轴座(无灯)]  49.09 72.17 180 top
SW8  -  [键盘轴座(无灯)]  68.84 62.3 0 top
SW9  -  [键盘轴座(无灯)]  9.59 52.42 0 top
SW10  -  [键盘轴座(无灯)]  29.34 52.42 0 top
SW11  -  [键盘轴座(无灯)]  49.09 52.42 0 top
SW12  -  [键盘轴座(无灯)]  9.59 32.67 0 top
SW13  -  [键盘轴座(无灯)]  29.34 32.67 0 top
SW14  -  [键盘轴座(无灯)]  49.09 32.67 0 top
SW15  -  [键盘轴座(无灯)]  68.84 22.8 0 top
SW16  -  [键盘轴座(无灯)]  19.47 12.92 0 top
SW17  -  [键盘轴座(无灯)]  49.09 12.92 0 top
SW18  MSK12C02  [SW-TH_MSK12C02]  70.07 100.98 0 bottom
U1  AMS1117-3.3  [SOT-223-4_L6.5-W3.5-P2.30-LS7.0-BR]  56.56 69.11 180 bottom
U2  TP4057  [SOT-23-6_L2.9-W1.6-P0.95-LS2.8-BR]  62.06 93.56 0 bottom
U3  E73-2G4M08S1C  [WIRELM-SMD_E73-2G4M08S1C]  39.37 63.55 180 bottom
USB1  TYPE-C 16PIN 2MD(073)  [USB-C-SMD_TYPE-C-6PIN-2MD-073]  42.16 98.28 0 bottom
X1  32.768kHz  [CRYSTAL-SMD_L3.2-W1.5-1]  35.56 73.18 0 bottom

## Footprints (pads in the part's own frame, mm; a bottom-side part is the same pattern mirrored in y, then rotated)
C0603
  rect 0.8x0.9 smd: 1(-0.7,0) 2(0.7,0)
CAP-SMD_L3.2-W1.6
  rect 1.2x1.4 smd: 1(-1.35,0) 2(1.35,0)
CONN-SMD_2.54-2PWT
  rect 1.2x4 smd: 1(-1.27,3.577) 2(1.27,3.577)
  rect 1.6x3.5 smd: 3(4.1,-3.577) 4(-4.1,-3.577)
CRYSTAL-SMD_L3.2-W1.5-1
  rect 1.05x1.7 smd: 1(-1.275,0) 2(1.275,0)
F1206
  rect 1.19x1.728 smd: 1(-1.445,0) 2(1.445,0)
LED0603-RD
  rect 0.8x0.8 smd: 1(-0.799,0) 2(0.799,0)
LED0603-RD_1
  rect 0.9x1 smd: 1(-0.85,0) 2(0.85,0)
LED0603-RD_RED
  rect 0.8x0.8 smd: 1(-0.799,-0.004) 2(0.799,0.004)
LL-34_L3.5-W1.5-RD
  rect 1.1x1.7 smd: 1(-1.7,0) 2(1.7,0)
PIN02
  rect 1.397x1.397 hole 0.762: 1(-1.27,0)
  round 1.397 hole 0.762: 2(1.27,0)
PIN04
  rect 1.397x1.397 hole 0.762: 1(0,3.81)
  round 1.397 hole 0.762: 2(0,1.27) 3(0,-1.27) 4(0,-3.81)
R0603
  rect 0.806x0.864 smd: 1(-0.753,0) 2(0.753,0)
SMA_L4.3-W2.6-LS5.0-FD
  rect 2.046x1.62 smd: 1(-2.304,-0.009) 2(2.304,0.009)
SOD-323_L1.7-W1.3-LS2.6-RD
  rect 0.83x0.63 smd: 1(-1.14,0) 2(1.14,0)
SOT-23-3_L2.9-W1.3-P1.90-LS2.4-BR
  rect 1.25x0.7 smd: 1(1,-0.95) 2(1,0.95) 3(-1,0)
SOT-23-6_L2.9-W1.6-P0.95-LS2.8-BR
  rect 1.1x0.6 smd: 1(1.35,-0.95) 2(1.35,0) 3(1.35,0.95) 4(-1.35,0.95) 5(-1.35,0) 6(-1.35,-0.95)
SOT-223-4_L6.5-W3.5-P2.30-LS7.0-BR
  rect 2.47x0.98 smd: 1(2.835,-2.3) 2(2.835,0) 3(2.835,2.3)
  rect 2.47x3.6 smd: 4(-2.835,0)
SW-TH_MSK12C02
  rect 0.6x1.524 smd: 1(-2.25,1.7) 2(0.75,1.7) 3(2.25,1.7)
  rect 1.2x0.7 smd: 4(-3.6,-1.7) 4(-3.6,0.6) 4(3.6,-1.7) 4(3.6,0.6)
USB-C-SMD_TYPE-C-6PIN-2MD-073
  rect 0.55x1.1 smd: 1(-3.2,2.375) 2(-2.4,2.375) 11(2.4,2.375) 12(3.2,2.375)
  rect 0.3x1.1 smd: 3(-1.75,2.375) 4(-1.25,2.375) 5(-0.75,2.375) 6(-0.25,2.375) 7(0.25,2.375) 8(0.75,2.375) 9(1.25,2.375) 10(1.75,2.375)
  oval 1.2x1.8 hole 0.6x1.2: 13(-4.325,-2.375) 14(4.325,-2.375)
  oval 1.1x2 hole 0.6x1.5: 13(-4.325,1.825) 14(4.325,1.825)
WIRELM-SMD_E73-2G4M08S1C
  rect 2x0.9 smd: 1(6.505,-7.015) 2(6.505,-5.745) 3(6.5,-4.5) 4(6.505,-3.205) 5(6.505,-1.935) 6(6.505,-0.665) 7(6.505,0.605) 8(6.505,1.875) 9(6.505,3.145) 10(6.505,4.415) 26(-6.505,4.415) 27(-6.505,3.145) 29(-6.505,1.875) 31(-6.505,0.605) 33(-6.505,-0.665) 35(-6.505,-1.935) 37(-6.505,-3.205) 39(-6.505,-4.475) 41(-6.505,-5.745) 43(-6.505,-7.015)
  rect 0.9x2 smd: 11(4.445,7.015) 13(3.175,7.015) 15(1.905,7.015) 17(0.635,7.015) 19(-0.635,7.015) 21(-1.905,7.015) 23(-3.175,7.015) 25(-4.445,7.015)
  rect 0.9x0.9 smd: 12(3.81,4.915) 14(2.54,4.915) 16(1.27,4.915) 18(0,4.915) 20(-1.27,4.915) 22(-2.54,4.915) 24(-3.81,4.915) 28(-4.405,2.51) 30(-4.405,1.24) 32(-4.405,-0.03) 34(-4.405,-1.3) 36(-4.405,-2.57) 38(-4.405,-3.84) 40(-4.405,-5.11) 42(-4.405,-6.38)
键盘轴座(无灯)
  rect 2.54x2.54 smd far side: 1(-3.175,-11.428) 2(10.795,-8.887)

## Nets
As in the schematic.

Pads without a net: U3 1 4 12 14 15 16 17 20 22 25 28 30 32 34 35 36 38 40 42; USB1 3 9

## Via types
v1: diameter 0.61, hole 0.305, Top Layer to Bottom Layer, 228 vias

## Routing (per net, layer and track width the routed paths; a pad name or vN(x,y) marks a point on that pad's centre or on a via; arc(x,y) is an arc through that point)
GND: length 14
  Top Layer w0.381: 41.28,75.08 v1(41.28,71.2)
  Bottom Layer w0.178: U3.21 41.28,69.75 41.78,69.24 42.67,69.24 43.18,68.73 U3.24
  Bottom Layer w0.381: 26.16,61.62 U3.5
  vias: v1(5.44,100.2) v1(5.44,95.12) v1(5.44,90.04) v1(5.44,84.96) v1(5.44,79.88) v1(5.44,74.8) v1(5.44,69.72) v1(5.44,64.64) v1(5.44,59.56) v1(5.44,54.48) v1(5.44,49.4) v1(5.44,44.32) v1(5.44,39.24) v1(5.44,34.16) v1(5.44,29.08) v1(5.44,24) v1(5.44,18.92) v1(5.44,13.84) v1(5.44,8.76) v1(10.52,100.2) v1(10.52,95.12) v1(10.52,84.96) v1(10.52,79.88) v1(10.52,74.8) v1(10.52,69.72) v1(10.52,64.64) v1(10.52,59.56) v1(10.52,49.4) v1(10.52,44.32) v1(10.52,39.24) v1(10.52,29.08) v1(10.52,24) v1(10.52,18.92) v1(10.52,13.84) v1(10.52,8.76) v1(15.6,100.2) v1(15.6,95.12) v1(15.6,84.96) v1(15.6,74.8) v1(15.6,64.64) v1(15.6,59.56) v1(15.6,54.48) v1(15.6,44.32) v1(15.6,39.24) v1(15.6,34.16) v1(15.6,24) v1(15.6,18.92) v1(15.6,13.84) v1(20.68,100.2) v1(20.68,95.12) v1(20.68,90.04) v1(20.68,84.96) v1(20.68,79.88) v1(20.68,69.72) v1(20.68,64.64) v1(20.68,54.48) v1(20.68,49.4) v1(20.68,44.32) v1(20.68,39.24) v1(20.68,34.16) v1(20.68,29.08) v1(20.68,18.92) v1(20.68,8.76) v1(24.48,70.99) v1(25.76,100.2) v1(25.76,90.04) v1(25.76,69.72) v1(25.76,59.56) v1(25.76,54.48) v1(25.76,49.4) v1(25.76,44.32) v1(25.76,39.24) v1(25.76,34.16) v1(25.76,18.92) v1(25.76,13.84) v1(26.73,77.33) v1(26.73,62.09) v1(26.73,57.01) v1(30.84,100.2) v1(30.84,84.96) v1(30.84,74.8) v1(30.84,49.4) v1(30.84,44.32) v1(30.84,39.24) v1(30.84,29.08) v1(30.84,24) v1(30.84,18.92) v1(30.84,13.84) v1(30.84,8.76) v1(34.64,47.24) v1(35.35,74.22) v1(35.92,100.2) v1(35.92,84.96) v1(35.92,44.32) v1(35.92,39.24) v1(35.92,34.16) v1(35.92,24) v1(35.92,18.92) v1(35.92,13.84) v1(35.92,8.76) v1(36.89,46.85) v1(39.72,47.24) v1(41,100.2) v1(41,79.88) v1(41,24) v1(41,18.92) v1(41,13.84) v1(41,8.76) v1(42.16,92.61) v1(42.16,91.34) v1(42.16,90.07) v1(46.08,44.32) v1(46.08,39.24) v1(46.08,34.16) v1(46.08,24) v1(46.08,18.92) v1(46.08,13.84) v1(47.05,77.33) v1(49.62,79.88) v1(49.62,74.8) v1(51.16,100.2) v1(51.16,95.12) v1(51.16,79.88) v1(51.16,54.48) v1(51.16,44.32) v1(51.16,39.24) v1(51.16,24) v1(51.16,18.92) v1(51.16,8.76) v1(54.36,84.61) v1(54.7,74.8) v1(55.12,84.61) v1(55.88,84.61) v1(56.24,100.2) v1(56.24,74.8) v1(56.24,64.64) v1(61.32,100.2) v1(61.32,90.04) v1(61.32,84.96) v1(61.32,79.88) v1(61.32,74.8) v1(61.32,69.72) v1(61.32,59.56) v1(61.32,54.48) v1(61.32,49.4) v1(61.32,44.32) v1(61.32,39.24) v1(61.32,34.16) v1(61.32,29.08) v1(61.32,24) v1(61.32,13.84) v1(61.32,8.76) v1(66.4,95.12) v1(66.4,90.04) v1(66.4,79.88) v1(66.4,74.8) v1(66.4,69.72) v1(66.4,64.64) v1(66.4,59.56) v1(66.4,54.48) v1(66.4,49.4) v1(66.4,44.32) v1(66.4,39.24) v1(66.4,34.16) v1(66.4,29.08) v1(66.4,24) v1(66.4,13.84) v1(66.4,8.76) v1(71.48,95.12) v1(71.48,84.96) v1(71.48,79.88) v1(71.48,74.8) v1(71.48,69.72) v1(71.48,54.48) v1(71.48,49.4) v1(71.48,44.32) v1(71.48,39.24) v1(71.48,34.16) v1(71.48,29.08) v1(71.48,24) v1(71.48,13.84) v1(71.48,8.76) v1(76.56,100.2) v1(76.56,95.12) v1(76.56,13.84) v1(76.56,8.76)
VBAT: length 33.6
  Bottom Layer w0.482: Q1.3 57.11,82.02 R8.2
  Bottom Layer w0.508: 65.28,92.61 C3.1 SW18.1 ; 65.28,92.61 65.28,90.33 63.75,88.8 59.69,88.8 58.04,87.15 R8.2 ; 65.28,92.61 U2.3
VBUS: length 68.6
  Top Layer w0.482: v1(42.93,77.37) v1(42.93,76.62) 42.93,74.06 49.02,67.97 49.02,67.46 v1(48.26,66.7)
  Bottom Layer w0.482: 59.31,91.46 59.27,91.42 52.06,91.42 50.67,90.04 50.67,88.32 53.47,85.52 53.47,83.59 52.85,82.97 Q1.1 ; LED2.2 52.07,91.45 ; U3.27 v1(48.26,66.7) v1(48.9,67.33) ; v1(42.93,76.62) v1(42.93,77.37) R3.2 39.82,77.37 38.86,78.32 38.86,79.53
  Bottom Layer w0.508: Q1.1 43.42,82.97 D18.1 F1.2 38.86,79.53 ; LED1.2 53.35,96.8 52.07,95.53 LED2.2 ; U2.4 59.82,92.61 59.31,92.1 59.31,91.46
BATTERY_PIN: length 54
  Top Layer w0.178: v1(39.37,68.47) 39.37,91.72 41.02,93.37 42.8,93.37 54.86,81.3 v1(56.9,81.3)
  Bottom Layer w0.178: v1(56.9,81.3) 59.06,81.3 59.55,81.79 R8.1
  Bottom Layer w0.508: R9.2 R8.1
BLUE_LED: length 13.8
  Bottom Layer w0.254: R7.2 22.22,59.84 24.26,57.81 32.87,57.81
COL1: length 105
  Bottom Layer w0.254: 17.21,69.63 18.08,69.63 23.17,64.54 31.62,64.54 32,64.16 U3.7 ; 17.21,69.63 17.21,25.87 19.18,23.9 25.78,23.9 27.18,22.5 27.18,10.47 27.09,10.38 ; 17.21,69.63 17.21,89.38
COL2: length 95.9
  Top Layer w0.254: v1(37.91,29.17) v1(37.91,30.13) v1(37.91,31.1) v1(37.91,48.92) v1(37.91,49.88) v1(37.91,50.85) 37.91,56.62 v1(20.77,73.75) v1(20.77,74.72) v1(20.77,75.68) 26.52,81.43 34.29,81.43 37.91,85.05 v1(37.91,88.42) v1(37.91,89.38) v1(37.91,90.35)
  Bottom Layer w0.254: 21.72,74.71 21.72,72.16 27.18,66.7 U3.9
COL3: length 131.2
  Top Layer w0.254: v1(57.66,48.92) v1(57.66,49.88) v1(57.66,50.85) v1(57.66,88.42) v1(57.66,89.38) v1(57.66,90.35) ; v1(55.76,48.92) v1(55.76,49.89) v1(55.76,50.85) 55.76,52.84 40.52,68.08 v1(40.52,73.75) v1(40.52,74.72) v1(40.52,75.68)
  Bottom Layer w0.254: 56.71,10.38 56.71,55.07 53.97,57.81 45.88,57.81
COL4: length 103.6
  Bottom Layer w0.254: 76.46,59.83 76.46,20.26 ; 76.46,59.83 70.23,66.06 66.55,66.06 63.37,62.89 45.88,62.89 ; 76.46,59.83 76.46,89.38
D+: length 45.9
  Top Layer w0.178: v1(47.5,64.16) 47.97,64.63 51.14,64.63 52.07,65.56 52.07,74.06 46.48,79.65 43.94,79.65 43.18,80.42 v1(43.18,90.19)
  Bottom Layer w0.178: v1(47.5,64.16) U3.31 ; USB1.6 41.91,97.05 42.16,97.31 42.67,97.31 42.91,97.07 USB1.8 42.91,91.6 D19.1 v1(43.18,90.19)
D-: length 45.9
  Top Layer w0.178: v1(47.5,65.43) 47.97,64.96 50.84,64.96 51.69,65.81 51.69,73.86 46.28,79.27 43.81,79.27 42.8,80.29 42.8,88.54 v1(41.14,90.19)
  Bottom Layer w0.178: 41.41,93.24 41.41,91.6 D20.1 v1(41.14,90.19) ; 41.41,93.24 42.16,93.24 42.41,93.49 USB1.7 ; 41.41,93.24 USB1.5 ; v1(47.5,65.43) U3.29
NRF_VDD: length 29.1
  Bottom Layer w0.508: 42.54,70.57 42.54,72.38 42.51,72.41 ; U1.4 U1.2 C1.1 48.01,69.11 44.7,72.41 42.51,72.41 ; 42.51,72.41 40.51,72.41 40,71.91 U3.19 ; J1.1 59.39,69.11
RESET: length 10.7
  Bottom Layer w0.178: U3.26 56.39,67.97 H1.1
ROW1: length 87.3
  Top Layer w0.254: 35.05,94.64 42.75,94.64 50.55,86.84 v1(54.9,86.84)
  Bottom Layer w0.254: 30.61,86.51 22.99,94.13 D2.1 ; 30.61,86.51 36.74,86.51 D3.1 ; 30.61,86.51 29.21,85.11 29.21,75.59 26.54,72.92 26.54,69.87 28.45,67.97 U3.10 ; D2.1 35.18,94.77 ; D2.1 22.99,94.77 22.99,96.92 21.59,98.32 D1.1 ; D4.1 v1(54.9,86.84)
  vias: v1(35.18,94.77)
ROW2: length 102.9
  Top Layer w0.254: v1(53.62,46.76) 57.4,46.76 61.98,51.33 v1(61.98,64.79) v1(63.03,64.79)
  Bottom Layer w0.254: v1(53.62,46.76) 50.8,46.76 41.66,55.9 41.66,59.71 35.94,65.43 U3.8 26.29,65.43 18.91,72.81 D5.1 D6.1 28.27,81.18 ; D7.1 D8.1
ROW3: length 45.5
  Bottom Layer w0.254: D11.1 36.07,41.68 22.99,54.76 D10.1 22.99,56.79 18.91,60.87 D9.1 32.87,62.89
ROW4: length 69
  Bottom Layer w0.254: U3.43 52.83,56.54 55.01,54.36 D15.1 47.24,41.68 42.74,37.18 D14.1 D13.1 22.99,35.27 22.99,40.92 21.08,42.82 D12.1
ROW5: length 57.6
  Top Layer w0.254: v1(40.64,32.92) v1(40.64,38)
  Bottom Layer w0.254: v1(40.64,38) 40.64,55.27 36.85,59.05 U3.3 ; D16.1 D17.1 42.74,23.58 40.64,25.68 v1(40.64,32.92)
SWC: length 13.5
  Bottom Layer w0.254: U3.39 J1.3
SWD: length 14
  Bottom Layer w0.254: J1.2 58.12,60.35 U3.37
$1N3146: length 2.9
  Bottom Layer w0.254: X1.1 34.93,72.54 U3.11
$1N3148: length 2.9
  Bottom Layer w0.254: X1.2 36.19,72.54 U3.13
$1N4004: length 28
  Bottom Layer w0.254: USB1.11 44.56,85.73 43.44,84.61 F1.1 38.86,88.67 39.76,89.57 USB1.2
$1N4007: length 3.2
  Bottom Layer w0.178: R1.1 43.91,92.84 USB1.10
$1N4018: length 3.2
  Bottom Layer w0.178: R2.1 40.91,93.26 USB1.4
$1N4421: length 1.6
  Bottom Layer w0.254: LED3.2 23.73,63.64 R7.1
$1N18766: length 26.2
  Bottom Layer w0.508: U1.3 55.77,71.41 60.71,76.35 60.71,78 58.29,80.41 55.38,80.41 C2.1 54.72,81.07 52.18,81.07 52.16,81.05 47.42,81.05 D18.2
$1N20018: length 22.2
  Bottom Layer w0.482: SW18.3 72.32,96.79 ; 72.32,96.79 72.32,91.94 69.98,89.6 H2.1 ; 72.32,96.79 70.82,98.29 SW18.2
$1N24035: length 3.1
  Bottom Layer w0.508: R6.2 58.22,93.56 U2.5
$1N24165: length 2.5
  Bottom Layer w0.508: LED2.1 R6.1
$1N24411: length 3.5
  Bottom Layer w0.508: LED1.1 R5.1
$1N24412: length 5.9
  Bottom Layer w0.508: 62.81,96.8 64.64,96.8 65.28,96.16 65.28,95.08 64.71,94.51 U2.1
$1N24490: length 3.1
  Bottom Layer w0.178: U2.6 58.15,94.51 R4.1
$1N53538: length 2.3
  Bottom Layer w0.254: 40.47,86.84 42.74,86.84
$1N53539: length 4.5
  Bottom Layer w0.254: D2.2 22.99,86.84
$1N53540: length 21.1
  Bottom Layer w0.254: D1.2 7.75,98.32 3.24,93.82 3.24,86.84
$1N53541: length 2.4
  Bottom Layer w0.254: D4.2 62.49,86.84
$1N53542: length 3.7
  Bottom Layer w0.254: 59.09,77.25 55.44,77.25
$1N53544: length 23.7
  Bottom Layer w0.254: 3.24,67.09 3.24,76.67 7.75,81.18 D5.2
$1N53545: length 25.2
  Bottom Layer w0.254: 3.24,47.34 3.24,58.38 7.75,62.89 D9.2
$1N53547: length 5.7
  Bottom Layer w0.254: D11.2 42.74,47.34
$1N53548: length 4
  Bottom Layer w0.254: 62.49,57.22 D8.2
$1N53550: length 4.3
  Bottom Layer w0.254: 22.99,27.59 D13.2
$1N53551: length 24.9
  Bottom Layer w0.254: 3.24,27.59 3.24,38.32 7.75,42.82 D12.2
$1N53552: length 23.6
  Bottom Layer w0.254: D16.2 17.65,21.87 13.12,17.33 13.12,7.84
$1N56506: length 4
  Bottom Layer w0.254: 22.99,47.34 22.99,51.36
$1N56555: length 4.3
  Bottom Layer w0.254: 42.74,27.59 D14.2
$1N56961: length 7.1
  Bottom Layer w0.254: 31.67,81.18 34.29,81.18 35.69,79.78 35.69,77.25
$1N57097: length 26.5
  Bottom Layer w0.254: D15.2 59.82,41.68 62.49,39.01 62.49,17.72
$1N57128: length 10.6
  Bottom Layer w0.254: D17.2 42.74,7.84

## Copper pours and planes (outline as drawn; the poured copper is in the pictures)
GND on Top Layer: -18.29,112.42 108.08,112.42 108.08,-7.72 -18.29,-7.72
GND on Bottom Layer: -12.19,117.63 103.5,117.63 103.5,-15.72 -12.19,-15.72

Small or netless copper shapes (teardrops, artwork), in the pictures only: 63 on Top Layer, 199 on Bottom Layer

## Text on the board
Bottom Silkscreen Layer: 3V3 | SWD | SWC | GND | +
